# Altium project broadcast.PrjPCB
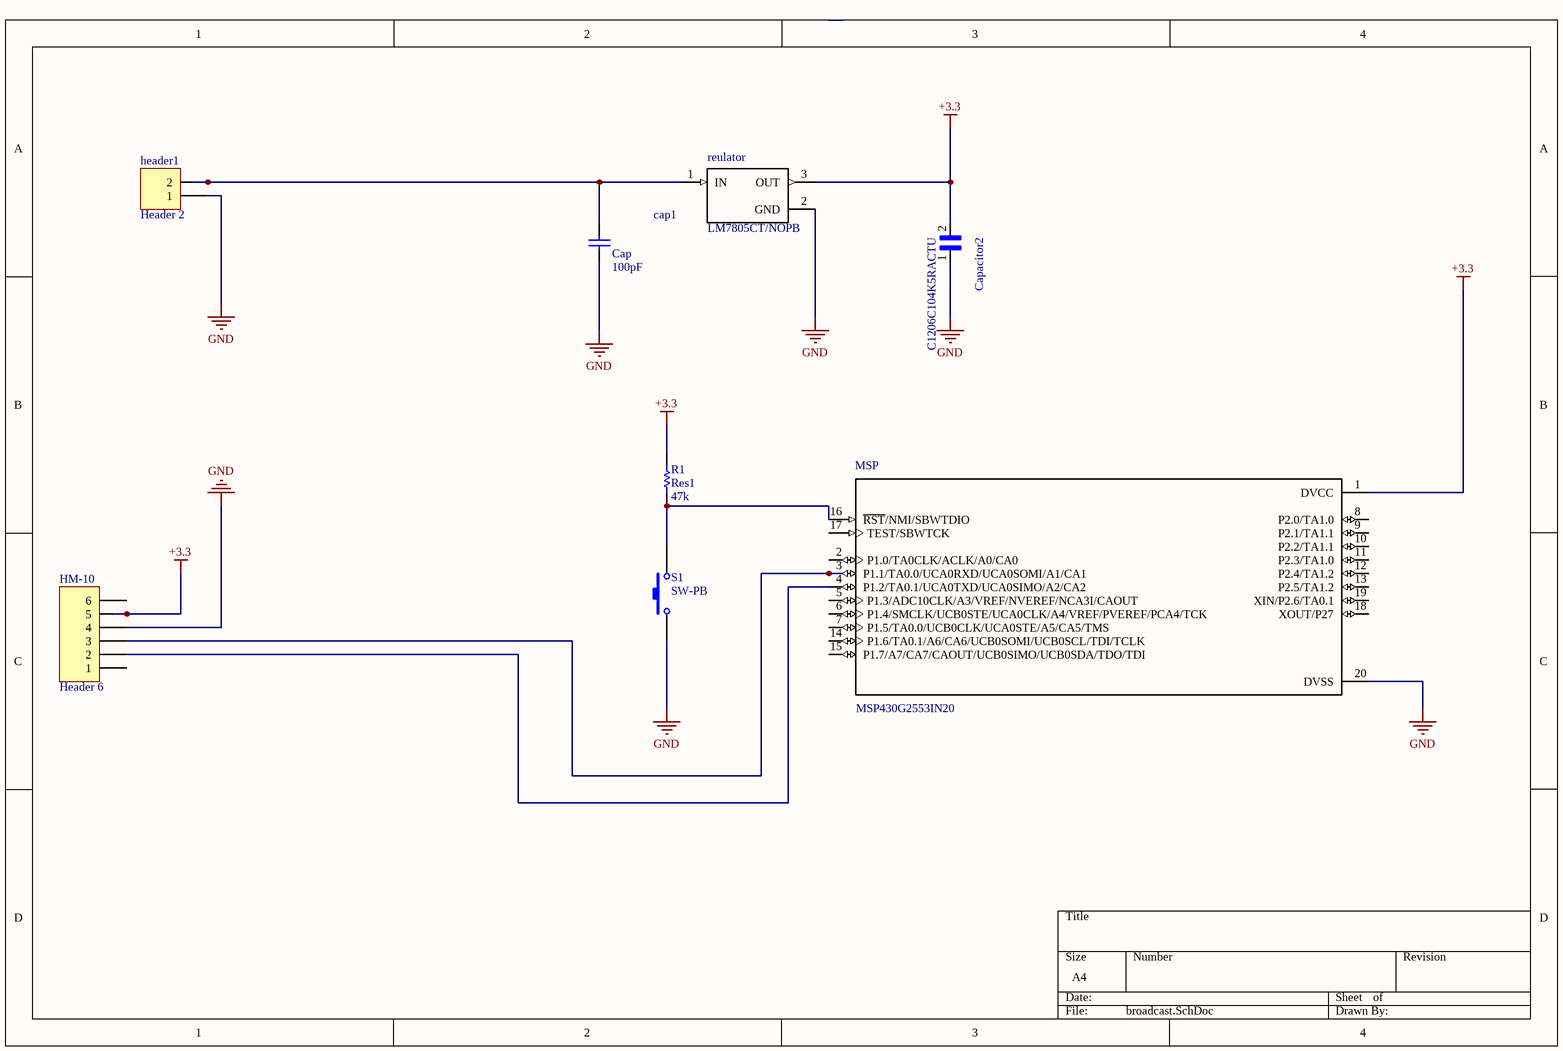
[diagram p0: broadcast.SchDoc]
1 sheet, 8 parts. Net scope: global (net labels, ports and power ports of the same name join across sheets).
Board file: broadcast.PcbDoc

## Sheet broadcast.SchDoc
size A4

### Parts
cap1  Cap  value 100pF  [RAD-0.3]
Capacitor2  C1206C104K5RACTU  [*VARC3216X85N]
header1  Header 2  [HDR1X2]
HM-10  Header 6  [HDR1X6]
MSP  MSP430G2553IN20  [*DIP794W45P254L2692H508Q20]
R1  Res1  value 47k  [AXIAL-0.3]
reulator  LM7805CT/NOPB  [*TO254P1054X470X2600-3]
S1  SW-PB  [SPST-2]

### Nets
+3.3: Capacitor2.2 HM-10.5 MSP.1(DVCC) R1.2 reulator.3(OUT)
GND: cap1.1 Capacitor2.1 header1.1 HM-10.4 MSP.20(DVSS) reulator.2(GND) S1.1
Netcap1_2: cap1.2 header1.2 reulator.1(IN)
NetHM-10_2: HM-10.2 MSP.4(P1.2/TA0.1/UCA0TXD/UCA0SIMO/A2/CA2)
NetHM-10_3: HM-10.3 MSP.3(P1.1/TA0.0/UCA0RXD/UCA0SOMI/A1/CA1)
NetMSP_16: MSP.16(~{RST}/NMI/SBWTDIO) R1.1 S1.2

Not connected (* = marked no-connect by the designer): HM-10 1 6; MSP 2(P1.0/TA0CLK/ACLK/A0/CA0) 5(P1.3/ADC10CLK/A3/VREF/NVEREF/NCA3I/CAOUT) 6(P1.4/SMCLK/UCB0STE/UCA0CLK/A4/VREF/PVEREF/PCA4/TCK) 7(P1.5/TA0.0/UCB0CLK/UCA0STE/A5/CA5/TMS) 8(P2.0/TA1.0) 9(P2.1/TA1.1) 10(P2.2/TA1.1) 11(P2.3/TA1.0) 12(P2.4/TA1.2) 13(P2.5/TA1.2) 14(P1.6/TA0.1/A6/CA6/UCB0SOMI/UCB0SCL/TDI/TCLK) 15(P1.7/A7/CA7/CAOUT/UCB0SIMO/UCB0SDA/TDO/TDI) 17(TEST/SBWTCK) 18(XOUT/P27) 19(XIN/P2.6/TA0.1)

### Library data of the parts
cap1 = Cap: Capacitor; Published: 8-Jun-2000; LatestRevisionDate: 17-Jul-2002; LatestRevisionNote: Re-released for DXP Platform.; PackageReference: RAD-0.3; Publisher: Altium Limited; PackageDescription: Radial Cap, Thru-Hole; 2 Leads; 0.3 in Pin Spacing
Capacitor2 = C1206C104K5RACTU: Surface Mound Multilayer Ceramic Chip Capacitor _SMD MLCC_ Surface Mound Multilayer Ceramic Chip Capacitor _SMD MLCC_; MF: KEMET; MP: C1206C104K5RACTU; Package: 1206 Kemet; Price: None; SnapEDA_Link: https://www.snapeda.com/parts/C1206C104K5RACTU/KEMET/view-part/78655/?ref=snap; Availability: Unavailable; Value: *
header1 = Header 2: Header, 2-Pin; LatestRevisionDate: 17-Jul-2002; LatestRevisionNote: Re-released for DXP Platform.; Publisher: Altium Limited
HM-10 = Header 6: Header, 6-Pin; LatestRevisionDate: 17-Jul-2002; LatestRevisionNote: Re-released for DXP Platform.; Publisher: Altium Limited
MSP = MSP430G2553IN20: MSP430G2x53, MSP430G2x13 Mixed Signal Microcontroller 20-PDIP -40 to 85; MF: Texas Instruments; SnapEDA_Link: https://www.snapeda.com/parts/MSP430G2553IN20/Texas%20Instruments/view-part/46372/?ref=snap; Package: PDIP-20 Texas Instruments; MP: MSP430G2553IN20; Availability: Unavailable; Price: None; Value: *
R1 = Res1: Resistor; Published: 8-Jun-2000; LatestRevisionDate: 17-Jul-2002; LatestRevisionNote: Re-released for DXP Platform.; PackageReference: AXIAL-0.3; Publisher: Altium Limited; PackageDescription: Axial Device, Thru-Hole; 2 Leads; 0.3 in Pin Spacing
reulator = LM7805CT/NOPB: IC REG DOÄRUSAL 5V 1A TO220AB; MF: ON Semiconductor; Availability: Unavailable; Price: None; MP: LM7805CT; Package: TO-220 ON Semiconductor; SnapEDA_Link: https://www.snapeda.com/parts/LM7805CT/ON%20Semiconductor/view-part/?ref=snap; Value: *
S1 = SW-PB: Switch; Published: 24-Mar-1999; LatestRevisionDate: 17-Jul-2002; LatestRevisionNote: Re-released for DXP Platform.; PackageReference: SPST-2; Publisher: Altium Limited; PackageDescription: Switch; 2 Leads